# Altium schematic sheet reTerm-HW-M-IOLINK-HMT.SchDoc: reTerm IOLINK HMT
size A4; DocumentNumber: 3; Revision: 1.0.0; SheetNumber: 2; SheetTotal: 4
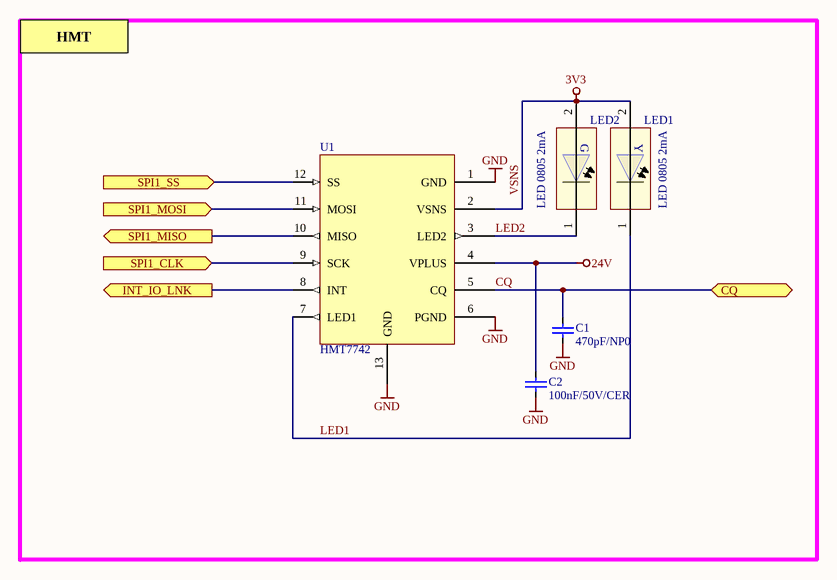
[diagram p0: reTerm-HW-M-IOLINK-HMT.SchDoc]

## Parts
C1  470pF/NP0  [C0603]
C2  100nF/50V/CER  [C0603]
LED1  LED 0805 2mA  [LED-0805-APT2012]
LED2  LED 0805 2mA  [LED-0805-APT2012]
U1  HMT7742  [DFN 12LD 4x3]

## Ports
CQ (bidir), INT_IO_LNK (out), SPI1_CLK (in), SPI1_MISO (out), SPI1_MOSI (in), SPI1_SS (in)

## Nets
24V: C2.1 U1.4(VPLUS)
GND: C1.2 C2.2 U1.1(GND) U1.6(PGND) U1.13(GND)
VSNS: LED1.2 LED2.2 U1.2(VSNS)  [also labelled 3V3]
CQ: C1.1 U1.5(CQ) ; port CQ
INT_IO_LNK: U1.8(INT) ; port INT_IO_LNK
LED1: LED1.1 U1.7(LED1)
LED2: LED2.1 U1.3(LED2)
SPI1_CLK: U1.9(SCK) ; port SPI1_CLK
SPI1_MISO: U1.10(MISO) ; port SPI1_MISO
SPI1_MOSI: U1.11(MOSI) ; port SPI1_MOSI
SPI1_SS: U1.12(SS) ; port SPI1_SS

## Notes on the sheet
- HMT
- (in symbol LED-APT2012LSECK/J3-PRV) G
- (in symbol LED-APT2012LSYCK/J3-PRV) Y

## Library data of the parts
C1 = CAP_470pF_NP0_: Supplier 1: Digi-Key; Supplier Part Number 1: 445-5648-1-ND
C2 = CAP_100nF_50V_CER: Supplier 1: Digi-Key; Supplier Part Number 1: 445-1314-1-ND
LED1 = LED-APT2012LSYCK/J3-PRV: LED-APT2012LSYCK/J3-PRV YEL 0805 2mA; Supplier 1: Digi-Key; Supplier 2: Arrow Electronics Inc.; Supplier Part Number 1: 754-1937-1-ND; Supplier Part Number 2: APT2012LSYCK/J3-PRV
LED2 = LED-APT2012LSECK/J3-PRV: LED-APT2012LSECK/J3-PRV GREEN 0805 2mA; Supplier 1: Digi-Key; Supplier 2: Arrow; Supplier Part Number 1: 754-1935-1-ND; Supplier Part Number 2: APT2012LSECK/J3-PRV
U1 = HMT7742: HMT7742 GENIE IO-Link DEVICE PHY